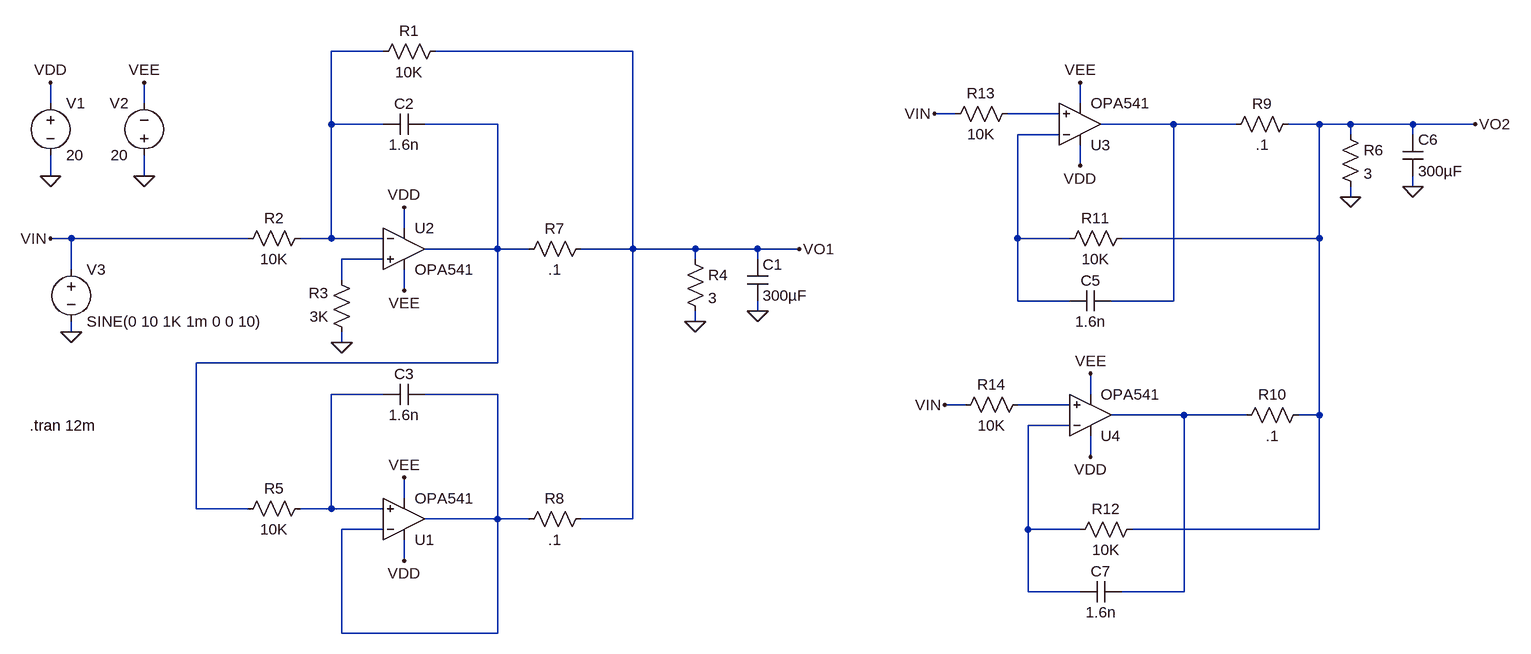
[diagram p0: schematic Test_opa541_model.asc]
Test_opa541_model.asc, the LTspice schematic file:
Version 4
SHEET 1 2064 1188
WIRE 288 -160 208 -160
WIRE 672 -160 368 -160
WIRE -224 -80 -224 -112
WIRE -80 -80 -80 -112
WIRE 1360 -80 1360 -112
WIRE 1168 -64 1136 -64
WIRE 1328 -64 1248 -64
WIRE 208 -48 208 -160
WIRE 288 -48 208 -48
WIRE 464 -48 352 -48
WIRE 1504 -48 1392 -48
WIRE 1600 -48 1504 -48
WIRE 1728 -48 1680 -48
WIRE 1776 -48 1728 -48
WIRE 1872 -48 1776 -48
WIRE 1968 -48 1872 -48
WIRE 1328 -32 1264 -32
WIRE 1776 -32 1776 -48
WIRE 1872 -32 1872 -48
WIRE 1360 16 1360 -16
WIRE -224 32 -224 0
WIRE -80 32 -80 0
WIRE 1872 48 1872 32
WIRE 1776 64 1776 48
WIRE 320 112 320 80
WIRE -192 128 -224 128
WIRE 80 128 -192 128
WIRE 208 128 208 -48
WIRE 208 128 160 128
WIRE 288 128 208 128
WIRE 1264 128 1264 -32
WIRE 1344 128 1264 128
WIRE 1728 128 1728 -48
WIRE 1728 128 1424 128
WIRE 464 144 464 -48
WIRE 464 144 352 144
WIRE 512 144 464 144
WIRE 672 144 672 -160
WIRE 672 144 592 144
WIRE 768 144 672 144
WIRE 864 144 768 144
WIRE 928 144 864 144
WIRE 288 160 224 160
WIRE 768 160 768 144
WIRE 864 160 864 144
WIRE -192 176 -192 128
WIRE 224 192 224 160
WIRE 320 208 320 176
WIRE 1264 224 1264 128
WIRE 1344 224 1264 224
WIRE 1504 224 1504 -48
WIRE 1504 224 1408 224
WIRE 864 240 864 224
WIRE 768 256 768 240
WIRE -192 272 -192 256
WIRE 224 288 224 272
WIRE 464 320 464 144
WIRE 464 320 0 320
WIRE 288 368 208 368
WIRE 464 368 352 368
WIRE 1376 368 1376 336
WIRE 1184 384 1152 384
WIRE 1344 384 1264 384
WIRE 1520 400 1408 400
WIRE 1616 400 1520 400
WIRE 1728 400 1728 128
WIRE 1728 400 1696 400
WIRE 1344 416 1280 416
WIRE 1376 464 1376 432
WIRE 320 528 320 496
WIRE 0 544 0 320
WIRE 80 544 0 544
WIRE 208 544 208 368
WIRE 208 544 160 544
WIRE 288 544 208 544
WIRE 464 560 464 368
WIRE 464 560 352 560
WIRE 512 560 464 560
WIRE 672 560 672 144
WIRE 672 560 592 560
WIRE 288 576 224 576
WIRE 1280 576 1280 416
WIRE 1360 576 1280 576
WIRE 1728 576 1728 400
WIRE 1728 576 1440 576
WIRE 320 624 320 592
WIRE 1280 672 1280 576
WIRE 1360 672 1280 672
WIRE 1520 672 1520 400
WIRE 1520 672 1424 672
WIRE 224 736 224 576
WIRE 464 736 464 560
WIRE 464 736 224 736
FLAG -224 32 0
FLAG -80 32 0
FLAG -224 -112 VDD
FLAG 320 80 VDD
FLAG -80 -112 VEE
FLAG 320 208 VEE
FLAG 224 288 0
FLAG 768 256 0
FLAG -192 272 0
FLAG 864 240 0
FLAG 320 496 VEE
FLAG 320 624 VDD
FLAG 1360 -112 VEE
FLAG 1360 16 VDD
FLAG 1776 64 0
FLAG 1872 48 0
FLAG -224 128 VIN
FLAG 1136 -64 VIN
FLAG 1376 336 VEE
FLAG 1376 464 VDD
FLAG 1152 384 VIN
FLAG 928 144 VO1
FLAG 1968 -48 VO2
SYMBOL voltage -224 -96 R0
WINDOW 123 0 0 Left 0
WINDOW 39 0 0 Left 0
SYMATTR InstName V1
SYMATTR Value 20
SYMBOL voltage -80 16 R180
WINDOW 0 24 96 Left 2
WINDOW 3 24 16 Left 2
WINDOW 123 0 0 Left 0
WINDOW 39 0 0 Left 0
SYMATTR InstName V2
SYMATTR Value 20
SYMBOL res 384 -176 R90
WINDOW 0 0 56 VBottom 2
WINDOW 3 32 56 VTop 2
SYMATTR InstName R1
SYMATTR Value 10K
SYMBOL res 176 112 R90
WINDOW 0 0 56 VBottom 2
WINDOW 3 32 56 VTop 2
SYMATTR InstName R2
SYMATTR Value 10K
SYMBOL res 240 288 R180
WINDOW 0 36 76 Left 2
WINDOW 3 36 40 Left 2
SYMATTR InstName R3
SYMATTR Value 3K
SYMBOL voltage -192 160 R0
WINDOW 123 0 0 Left 0
WINDOW 39 0 0 Left 0
SYMATTR InstName V3
SYMATTR Value SINE(0 10 1K 1m 0 0 10)
SYMBOL res 752 144 R0
SYMATTR InstName R4
SYMATTR Value 3
SYMBOL Hab_OpAmp\\OPA541 320 80 R0
SYMATTR InstName U2
SYMBOL cap 848 160 R0
SYMATTR InstName C1
SYMATTR Value 300µF
SYMBOL cap 352 -64 R90
WINDOW 0 0 32 VBottom 2
WINDOW 3 32 32 VTop 2
SYMATTR InstName C2
SYMATTR Value 1.6n
SYMBOL res 176 528 R90
WINDOW 0 0 56 VBottom 2
WINDOW 3 32 56 VTop 2
SYMATTR InstName R5
SYMATTR Value 10K
SYMBOL cap 352 352 R90
WINDOW 0 0 32 VBottom 2
WINDOW 3 32 32 VTop 2
SYMATTR InstName C3
SYMATTR Value 1.6n
SYMBOL res 608 128 R90
WINDOW 0 0 56 VBottom 2
WINDOW 3 32 56 VTop 2
SYMATTR InstName R7
SYMATTR Value .1
SYMBOL res 608 544 R90
WINDOW 0 0 56 VBottom 2
WINDOW 3 32 56 VTop 2
SYMATTR InstName R8
SYMATTR Value .1
SYMBOL Hab_OpAmp\\OPA541 320 624 M180
SYMATTR InstName U1
SYMBOL cap 1408 208 R90
WINDOW 0 0 32 VBottom 2
WINDOW 3 32 32 VTop 2
SYMATTR InstName C5
SYMATTR Value 1.6n
SYMBOL Hab_OpAmp\\OPA541 1360 16 M180
SYMATTR InstName U3
SYMBOL res 1760 -48 R0
SYMATTR InstName R6
SYMATTR Value 3
SYMBOL cap 1856 -32 R0
SYMATTR InstName C6
SYMATTR Value 300µF
SYMBOL res 1696 -64 R90
WINDOW 0 0 56 VBottom 2
WINDOW 3 32 56 VTop 2
SYMATTR InstName R9
SYMATTR Value .1
SYMBOL cap 1424 656 R90
WINDOW 0 0 32 VBottom 2
WINDOW 3 32 32 VTop 2
SYMATTR InstName C7
SYMATTR Value 1.6n
SYMBOL Hab_OpAmp\\OPA541 1376 464 M180
SYMATTR InstName U4
SYMBOL res 1712 384 R90
WINDOW 0 0 56 VBottom 2
WINDOW 3 32 56 VTop 2
SYMATTR InstName R10
SYMATTR Value .1
SYMBOL res 1440 112 R90
WINDOW 0 0 56 VBottom 2
WINDOW 3 32 56 VTop 2
SYMATTR InstName R11
SYMATTR Value 10K
SYMBOL res 1456 560 R90
WINDOW 0 0 56 VBottom 2
WINDOW 3 32 56 VTop 2
SYMATTR InstName R12
SYMATTR Value 10K
SYMBOL res 1264 -80 R90
WINDOW 0 0 56 VBottom 2
WINDOW 3 32 56 VTop 2
SYMATTR InstName R13
SYMATTR Value 10K
SYMBOL res 1280 368 R90
WINDOW 0 0 56 VBottom 2
WINDOW 3 32 56 VTop 2
SYMATTR InstName R14
SYMATTR Value 10K
TEXT -256 416 Left 2 !.tran 12m

The netlist it stands for:
* Test_opa541_model.asc
V1 VDD 0 20
V2 0 VEE 20
R1 VO1 N001 10K
R2 N001 VIN 10K
R3 0 N006 3K
V3 VIN 0 SINE(0 10 1K 1m 0 0 10)
R4 VO1 0 3
* U2: OPA541 (symbol Hab_OpAmp\OPA541 not available, pins judged from their places): In+=N006 In-=N001 V+=VDD V-=VEE OUT=N003
C1 VO1 0 300µF
C2 N003 N001 1.6n
R5 N007 N003 10K
C3 N008 N007 1.6n
R7 VO1 N003 .1
R8 VO1 N008 .1
* U1: OPA541 (symbol Hab_OpAmp\OPA541 not available, pins judged from their places): In+=N007 In-=N008 V+=VDD V-=VEE OUT=N008
C5 N004 N005 1.6n
* U3: OPA541 (symbol Hab_OpAmp\OPA541 not available, pins judged from their places): In+=N002 In-=N005 V+=VDD V-=VEE OUT=N004
R6 VO2 0 3
C6 VO2 0 300µF
R9 VO2 N004 .1
C7 N010 N011 1.6n
* U4: OPA541 (symbol Hab_OpAmp\OPA541 not available, pins judged from their places): In+=N009 In-=N011 V+=VDD V-=VEE OUT=N010
R10 VO2 N010 .1
R11 VO2 N005 10K
R12 VO2 N011 10K
R13 N002 VIN 10K
R14 N009 VIN 10K
.tran 12m
.backanno
.end